# Altium schematic sheet 03cpu_sodimm.SchDoc
size B portrait
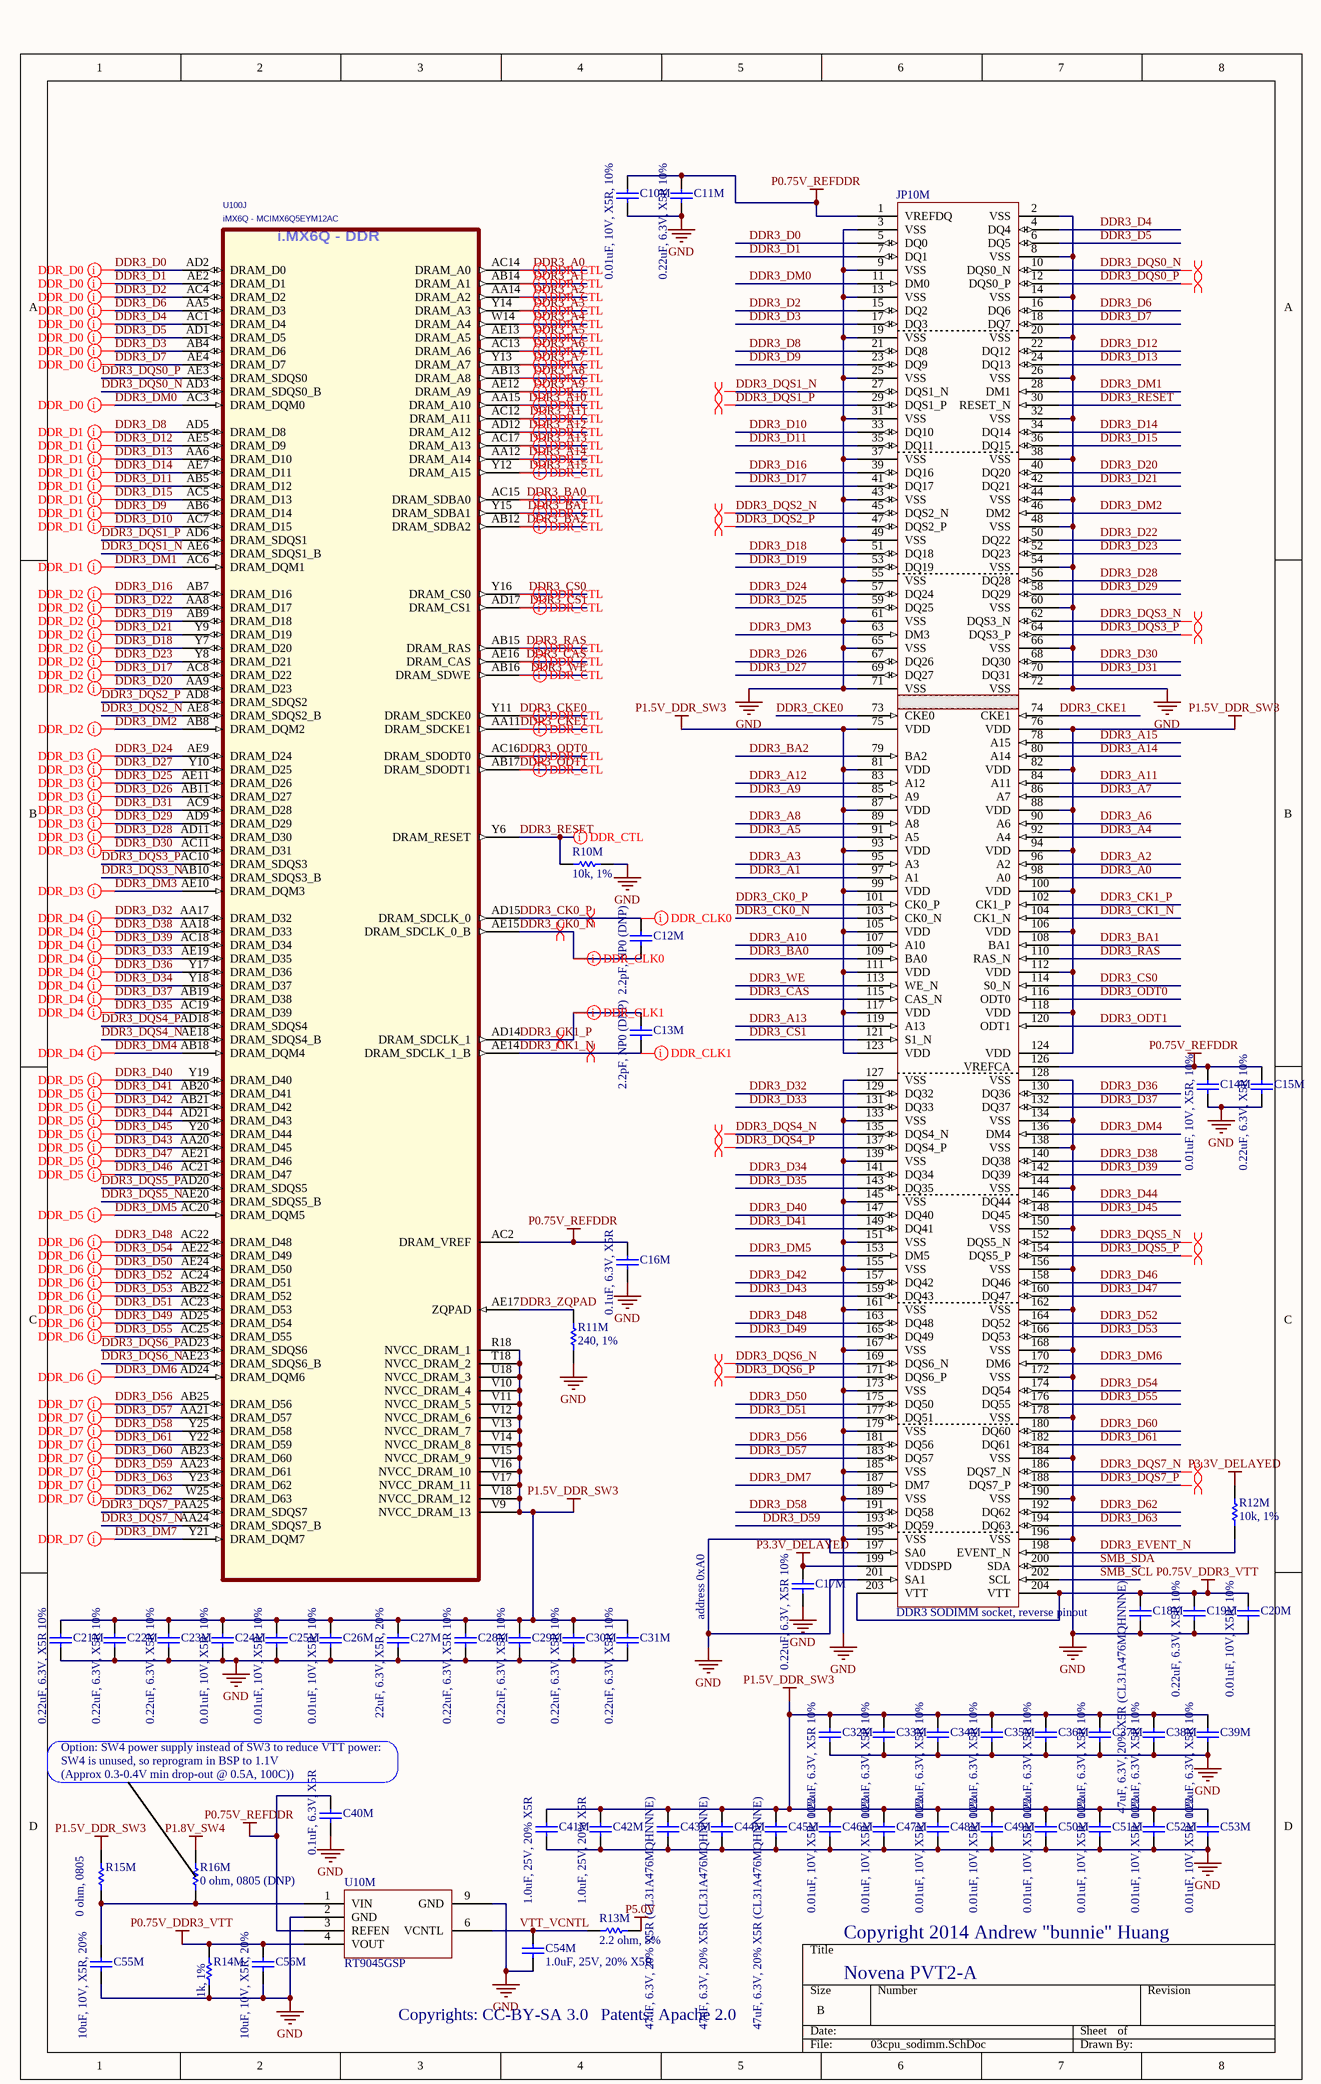
[diagram p0: 03cpu_sodimm.SchDoc]

## Parts
C10M  0.01uF, 10V, X5R, 10%  [CAPC0603N_B]
C11M  0.22uF, 6.3V, X5R 10%  [CAPC0603N_B]
C12M  2.2pF, NP0 (DNP)  [CAPC1005N]
C13M  2.2pF, NP0 (DNP)  [CAPC1005N]
C14M  0.01uF, 10V, X5R, 10%  [CAPC0603N_B]
C15M  0.22uF, 6.3V, X5R 10%  [CAPC0603N_B]
C16M  0.1uF, 6.3V, X5R  [CAPC0603N_B]
C17M  0.22uF, 6.3V, X5R 10%  [CAPC0603N_B]
C18M  47uF, 6.3V, 20% X5R (CL31A476MQHNNNE)  [CAPC3216N]
C19M  0.22uF, 6.3V, X5R 10%  [CAPC0603N_B]
C20M  0.01uF, 10V, X5R, 10%  [CAPC0603N_B]
C21M  0.22uF, 6.3V, X5R 10%  [CAPC0603N_B]
C22M  0.22uF, 6.3V, X5R 10%  [CAPC0603N_B]
C23M  0.22uF, 6.3V, X5R 10%  [CAPC0603N_B]
C24M  0.01uF, 10V, X5R, 10%  [CAPC0603N_B]
C25M  0.01uF, 10V, X5R, 10%  [CAPC0603N_B]
C26M  0.01uF, 10V, X5R, 10%  [CAPC0603N_B]
C27M  22uF, 6.3V, X5R, 20%  [CAPC1608N_HD]
C28M  0.22uF, 6.3V, X5R 10%  [CAPC0603N_B]
C29M  0.22uF, 6.3V, X5R 10%  [CAPC0603N_B]
C30M  0.22uF, 6.3V, X5R 10%  [CAPC0603N_B]
C31M  0.22uF, 6.3V, X5R 10%  [CAPC0603N_B]
C32M  0.22uF, 6.3V, X5R 10%  [CAPC0603N_B]
C33M  0.22uF, 6.3V, X5R 10%  [CAPC0603N_B]
C34M  0.22uF, 6.3V, X5R 10%  [CAPC0603N_B]
C35M  0.22uF, 6.3V, X5R 10%  [CAPC0603N_B]
C36M  0.22uF, 6.3V, X5R 10%  [CAPC0603N_B]
C37M  0.22uF, 6.3V, X5R 10%  [CAPC0603N_B]
C38M  0.22uF, 6.3V, X5R 10%  [CAPC0603N_B]
C39M  0.22uF, 6.3V, X5R 10%  [CAPC0603N_B]
C40M  0.1uF, 6.3V, X5R  [CAPC0603N_B]
C41M  1.0uF, 25V, 20% X5R  [CAPC1608N]
C42M  1.0uF, 25V, 20% X5R  [CAPC1608N]
C43M  47uF, 6.3V, 20% X5R (CL31A476MQHNNNE)  [CAPC3216N]
C44M  47uF, 6.3V, 20% X5R (CL31A476MQHNNNE)  [CAPC3216N]
C45M  47uF, 6.3V, 20% X5R (CL31A476MQHNNNE)  [CAPC3216N]
C46M  0.01uF, 10V, X5R, 10%  [CAPC0603N_B]
C47M  0.01uF, 10V, X5R, 10%  [CAPC0603N_B]
C48M  0.01uF, 10V, X5R, 10%  [CAPC0603N_B]
C49M  0.01uF, 10V, X5R, 10%  [CAPC0603N_B]
C50M  0.01uF, 10V, X5R, 10%  [CAPC0603N_B]
C51M  0.01uF, 10V, X5R, 10%  [CAPC0603N_B]
C52M  0.01uF, 10V, X5R, 10%  [CAPC0603N_B]
C53M  0.01uF, 10V, X5R, 10%  [CAPC0603N_B]
C54M  1.0uF, 25V, 20% X5R  [CAPC1608N]
C55M  10uF, 10V, X5R, 20%  [CAPC1608N]
C56M  10uF, 10V, X5R, 20%  [CAPC1608N]
JP10M  DDR3 SODIMM socket, reverse pinout  [DDR3_SODIMM_REV]
R10M  10k, 1%  [RESC1005N]
R11M  240, 1%  [RESC1005N]
R12M  10k, 1%  [RESC1005N]
R13M  2.2 ohm, 5%  [RESC1005N]
R14M  1k, 1%  [RESC1005N]
R15M  0 ohm, 0805  [RESC2012N]
R16M  0 ohm, 0805 (DNP)  [RESC2012N]
U10M  RT9045GSP  [SOIC127P600_HS-8N]
U100  iMX6Q - MCIMX6Q5EYM12AC  [FREESCALE_BGA624C80P25X25_2100X2100X216]  (part J of 12)

## Nets
GND: C10M.2 C11M.2 C14M.2 C15M.2 C16M.2 C17M.2 C18M.2 C19M.2 C20M.2 C21M.2 C22M.2 C23M.2 C24M.2 C25M.2 C26M.2 C27M.2 C28M.2 C29M.2 C30M.2 C31M.2 C32M.2 C33M.2 C34M.2 C35M.2 C36M.2 C37M.2 C38M.2 C39M.2 C40M.2 C41M.2 C42M.2 C43M.2 C44M.2 C45M.2 C46M.2 C47M.2 C48M.2 C49M.2 C50M.2 C51M.2 C52M.2 C53M.2 C54M.2 C55M.2 C56M.2 JP10M.2(VSS) JP10M.3(VSS) JP10M.8(VSS) JP10M.9(VSS) JP10M.13(VSS) JP10M.14(VSS) JP10M.19(VSS) JP10M.20(VSS) JP10M.25(VSS) JP10M.26(VSS) JP10M.31(VSS) JP10M.32(VSS) JP10M.37(VSS) JP10M.38(VSS) JP10M.43(VSS) JP10M.44(VSS) JP10M.48(VSS) JP10M.49(VSS) JP10M.54(VSS) JP10M.55(VSS) JP10M.60(VSS) JP10M.61(VSS) JP10M.65(VSS) JP10M.66(VSS) JP10M.71(VSS) JP10M.72(VSS) JP10M.127(VSS) JP10M.128(VSS) JP10M.133(VSS) JP10M.134(VSS) JP10M.138(VSS) JP10M.139(VSS) JP10M.144(VSS) JP10M.145(VSS) JP10M.150(VSS) JP10M.151(VSS) JP10M.155(VSS) JP10M.156(VSS) JP10M.161(VSS) JP10M.162(VSS) JP10M.167(VSS) JP10M.168(VSS) JP10M.172(VSS) JP10M.173(VSS) JP10M.178(VSS) JP10M.179(VSS) JP10M.184(VSS) JP10M.185(VSS) JP10M.189(VSS) JP10M.190(VSS) JP10M.195(VSS) JP10M.196(VSS) JP10M.197(SA0) JP10M.201(SA1) R10M.2 R11M.2 R14M.2 U10M.2(GND) U10M.9(GND)
P0.75V_DDR3_VTT: C18M.1 C19M.1 C20M.1 C56M.1 JP10M.203(VTT) JP10M.204(VTT) R14M.1 U10M.4(VOUT)
P0.75V_REFDDR: C10M.1 C11M.1 C14M.1 C15M.1 C16M.1 C40M.1 JP10M.1(VREFDQ) JP10M.126(VREFCA) U10M.3(REFEN) U100.AC2(DRAM_VREF)
P1.5V_DDR_SW3: C21M.1 C22M.1 C23M.1 C24M.1 C25M.1 C26M.1 C27M.1 C28M.1 C29M.1 C30M.1 C31M.1 C32M.1 C33M.1 C34M.1 C35M.1 C36M.1 C37M.1 C38M.1 C39M.1 C41M.1 C42M.1 C43M.1 C44M.1 C45M.1 C46M.1 C47M.1 C48M.1 C49M.1 C50M.1 C51M.1 C52M.1 C53M.1 JP10M.75(VDD) JP10M.76(VDD) JP10M.81(VDD) JP10M.82(VDD) JP10M.87(VDD) JP10M.88(VDD) JP10M.93(VDD) JP10M.94(VDD) JP10M.99(VDD) JP10M.100(VDD) JP10M.105(VDD) JP10M.106(VDD) JP10M.111(VDD) JP10M.112(VDD) JP10M.117(VDD) JP10M.118(VDD) JP10M.123(VDD) JP10M.124(VDD) R15M.1 U100.R18(NVCC_DRAM_1) U100.T18(NVCC_DRAM_2) U100.U18(NVCC_DRAM_3) U100.V9(NVCC_DRAM_13) U100.V10(NVCC_DRAM_4) U100.V11(NVCC_DRAM_5) U100.V12(NVCC_DRAM_6) U100.V13(NVCC_DRAM_7) U100.V14(NVCC_DRAM_8) U100.V15(NVCC_DRAM_9) U100.V16(NVCC_DRAM_10) U100.V17(NVCC_DRAM_11) U100.V18(NVCC_DRAM_12)
P1.8V_SW4: R16M.1
P3.3V_DELAYED: C17M.1 JP10M.199(VDDSPD) R12M.1
P5.0V: R13M.1
DDR3_A0: JP10M.98(A0) U100.AC14(DRAM_A0)
DDR3_A1: JP10M.97(A1) U100.AB14(DRAM_A1)
DDR3_A2: JP10M.96(A2) U100.AA14(DRAM_A2)
DDR3_A3: JP10M.95(A3) U100.Y14(DRAM_A3)
DDR3_A4: JP10M.92(A4) U100.W14(DRAM_A4)
DDR3_A5: JP10M.91(A5) U100.AE13(DRAM_A5)
DDR3_A6: JP10M.90(A6) U100.AC13(DRAM_A6)
DDR3_A7: JP10M.86(A7) U100.Y13(DRAM_A7)
DDR3_A8: JP10M.89(A8) U100.AB13(DRAM_A8)
DDR3_A9: JP10M.85(A9) U100.AE12(DRAM_A9)
DDR3_A10: JP10M.107(A10) U100.AA15(DRAM_A10)
DDR3_A11: JP10M.84(A11) U100.AC12(DRAM_A11)
DDR3_A12: JP10M.83(A12) U100.AD12(DRAM_A12)
DDR3_A13: JP10M.119(A13) U100.AC17(DRAM_A13)
DDR3_A14: JP10M.80(A14) U100.AA12(DRAM_A14)
DDR3_A15: JP10M.78(A15) U100.Y12(DRAM_A15)
DDR3_BA0: JP10M.109(BA0) U100.AC15(DRAM_SDBA0)
DDR3_BA1: JP10M.108(BA1) U100.Y15(DRAM_SDBA1)
DDR3_BA2: JP10M.79(BA2) U100.AB12(DRAM_SDBA2)
DDR3_CAS: JP10M.115(CAS_N) U100.AE16(DRAM_CAS)
DDR3_CK0_N: C12M.2 JP10M.103(CK0_N) U100.AE15(DRAM_SDCLK_0_B)
DDR3_CK0_P: C12M.1 JP10M.101(CK0_P) U100.AD15(DRAM_SDCLK_0)
DDR3_CK1_N: C13M.2 JP10M.104(CK1_N) U100.AE14(DRAM_SDCLK_1_B)
DDR3_CK1_P: C13M.1 JP10M.102(CK1_P) U100.AD14(DRAM_SDCLK_1)
DDR3_CKE0: JP10M.73(CKE0) U100.Y11(DRAM_SDCKE0)
DDR3_CKE1: JP10M.74(CKE1) U100.AA11(DRAM_SDCKE1)
DDR3_CS0: JP10M.114(S0_N) U100.Y16(DRAM_CS0)
DDR3_CS1: JP10M.121(S1_N) U100.AD17(DRAM_CS1)
DDR3_D0: JP10M.5(DQ0) U100.AD2(DRAM_D0)
DDR3_D1: JP10M.7(DQ1) U100.AE2(DRAM_D1)
DDR3_D2: JP10M.15(DQ2) U100.AC4(DRAM_D2)
DDR3_D3: JP10M.17(DQ3) U100.AB4(DRAM_D6)
DDR3_D4: JP10M.4(DQ4) U100.AC1(DRAM_D4)
DDR3_D5: JP10M.6(DQ5) U100.AD1(DRAM_D5)
DDR3_D6: JP10M.16(DQ6) U100.AA5(DRAM_D3)
DDR3_D7: JP10M.18(DQ7) U100.AE4(DRAM_D7)
DDR3_D8: JP10M.21(DQ8) U100.AD5(DRAM_D8)
DDR3_D9: JP10M.23(DQ9) U100.AB6(DRAM_D14)
DDR3_D10: JP10M.33(DQ10) U100.AC7(DRAM_D15)
DDR3_D11: JP10M.35(DQ11) U100.AB5(DRAM_D12)
DDR3_D12: JP10M.22(DQ12) U100.AE5(DRAM_D9)
DDR3_D13: JP10M.24(DQ13) U100.AA6(DRAM_D10)
DDR3_D14: JP10M.34(DQ14) U100.AE7(DRAM_D11)
DDR3_D15: JP10M.36(DQ15) U100.AC5(DRAM_D13)
DDR3_D16: JP10M.39(DQ16) U100.AB7(DRAM_D16)
DDR3_D17: JP10M.41(DQ17) U100.AC8(DRAM_D22)
DDR3_D18: JP10M.51(DQ18) U100.Y7(DRAM_D20)
DDR3_D19: JP10M.53(DQ19) U100.AB9(DRAM_D18)
DDR3_D20: JP10M.40(DQ20) U100.AA9(DRAM_D23)
DDR3_D21: JP10M.42(DQ21) U100.Y9(DRAM_D19)
DDR3_D22: JP10M.50(DQ22) U100.AA8(DRAM_D17)
DDR3_D23: JP10M.52(DQ23) U100.Y8(DRAM_D21)
DDR3_D24: JP10M.57(DQ24) U100.AE9(DRAM_D24)
DDR3_D25: JP10M.59(DQ25) U100.AE11(DRAM_D26)
DDR3_D26: JP10M.67(DQ26) U100.AB11(DRAM_D27)
DDR3_D27: JP10M.69(DQ27) U100.Y10(DRAM_D25)
DDR3_D28: JP10M.56(DQ28) U100.AD11(DRAM_D30)
DDR3_D29: JP10M.58(DQ29) U100.AD9(DRAM_D29)
DDR3_D30: JP10M.68(DQ30) U100.AC11(DRAM_D31)
DDR3_D31: JP10M.70(DQ31) U100.AC9(DRAM_D28)
DDR3_D32: JP10M.129(DQ32) U100.AA17(DRAM_D32)
DDR3_D33: JP10M.131(DQ33) U100.AE19(DRAM_D35)
DDR3_D34: JP10M.141(DQ34) U100.Y18(DRAM_D37)
DDR3_D35: JP10M.143(DQ35) U100.AC19(DRAM_D39)
DDR3_D36: JP10M.130(DQ36) U100.Y17(DRAM_D36)
DDR3_D37: JP10M.132(DQ37) U100.AB19(DRAM_D38)
DDR3_D38: JP10M.140(DQ38) U100.AA18(DRAM_D33)
DDR3_D39: JP10M.142(DQ39) U100.AC18(DRAM_D34)
DDR3_D40: JP10M.147(DQ40) U100.Y19(DRAM_D40)
DDR3_D41: JP10M.149(DQ41) U100.AB20(DRAM_D41)
DDR3_D42: JP10M.157(DQ42) U100.AB21(DRAM_D42)
DDR3_D43: JP10M.159(DQ43) U100.AA20(DRAM_D45)
DDR3_D44: JP10M.146(DQ44) U100.AD21(DRAM_D43)
DDR3_D45: JP10M.148(DQ45) U100.Y20(DRAM_D44)
DDR3_D46: JP10M.158(DQ46) U100.AC21(DRAM_D47)
DDR3_D47: JP10M.160(DQ47) U100.AE21(DRAM_D46)
DDR3_D48: JP10M.163(DQ48) U100.AC22(DRAM_D48)
DDR3_D49: JP10M.165(DQ49) U100.AD25(DRAM_D54)
DDR3_D50: JP10M.175(DQ50) U100.AE24(DRAM_D50)
DDR3_D51: JP10M.177(DQ51) U100.AC23(DRAM_D53)
DDR3_D52: JP10M.164(DQ52) U100.AC24(DRAM_D51)
DDR3_D53: JP10M.166(DQ53) U100.AB22(DRAM_D52)
DDR3_D54: JP10M.174(DQ54) U100.AE22(DRAM_D49)
DDR3_D55: JP10M.176(DQ55) U100.AC25(DRAM_D55)
DDR3_D56: JP10M.181(DQ56) U100.AB25(DRAM_D56)
DDR3_D57: JP10M.183(DQ57) U100.AA21(DRAM_D57)
DDR3_D58: JP10M.191(DQ58) U100.Y25(DRAM_D58)
DDR3_D59: JP10M.193(DQ59) U100.AA23(DRAM_D61)
DDR3_D60: JP10M.180(DQ60) U100.AB23(DRAM_D60)
DDR3_D61: JP10M.182(DQ61) U100.Y22(DRAM_D59)
DDR3_D62: JP10M.192(DQ62) U100.W25(DRAM_D63)
DDR3_D63: JP10M.194(DQ63) U100.Y23(DRAM_D62)
DDR3_DM0: JP10M.11(DM0) U100.AC3(DRAM_DQM0)
DDR3_DM1: JP10M.28(DM1) U100.AC6(DRAM_DQM1)
DDR3_DM2: JP10M.46(DM2) U100.AB8(DRAM_DQM2)
DDR3_DM3: JP10M.63(DM3) U100.AE10(DRAM_DQM3)
DDR3_DM4: JP10M.136(DM4) U100.AB18(DRAM_DQM4)
DDR3_DM5: JP10M.153(DM5) U100.AC20(DRAM_DQM5)
DDR3_DM6: JP10M.170(DM6) U100.AD24(DRAM_DQM6)
DDR3_DM7: JP10M.187(DM7) U100.Y21(DRAM_DQM7)
DDR3_DQS0_N: JP10M.10(DQS0_N) U100.AD3(DRAM_SDQS0_B)
DDR3_DQS0_P: JP10M.12(DQS0_P) U100.AE3(DRAM_SDQS0)
DDR3_DQS1_N: JP10M.27(DQS1_N) U100.AE6(DRAM_SDQS1_B)
DDR3_DQS1_P: JP10M.29(DQS1_P) U100.AD6(DRAM_SDQS1)
DDR3_DQS2_N: JP10M.45(DQS2_N) U100.AE8(DRAM_SDQS2_B)
DDR3_DQS2_P: JP10M.47(DQS2_P) U100.AD8(DRAM_SDQS2)
DDR3_DQS3_N: JP10M.62(DQS3_N) U100.AB10(DRAM_SDQS3_B)
DDR3_DQS3_P: JP10M.64(DQS3_P) U100.AC10(DRAM_SDQS3)
DDR3_DQS4_N: JP10M.135(DQS4_N) U100.AE18(DRAM_SDQS4_B)
DDR3_DQS4_P: JP10M.137(DQS4_P) U100.AD18(DRAM_SDQS4)
DDR3_DQS5_N: JP10M.152(DQS5_N) U100.AE20(DRAM_SDQS5_B)
DDR3_DQS5_P: JP10M.154(DQS5_P) U100.AD20(DRAM_SDQS5)
DDR3_DQS6_N: JP10M.169(DQS6_N) U100.AE23(DRAM_SDQS6_B)
DDR3_DQS6_P: JP10M.171(DQS6_P) U100.AD23(DRAM_SDQS6)
DDR3_DQS7_N: JP10M.186(DQS7_N) U100.AA24(DRAM_SDQS7_B)
DDR3_DQS7_P: JP10M.188(DQS7_P) U100.AA25(DRAM_SDQS7)
DDR3_EVENT_N: JP10M.198(EVENT_N) R12M.2
DDR3_ODT0: JP10M.116(ODT0) U100.AC16(DRAM_SDODT0)
DDR3_ODT1: JP10M.120(ODT1) U100.AB17(DRAM_SDODT1)
DDR3_RAS: JP10M.110(RAS_N) U100.AB15(DRAM_RAS)
DDR3_RESET: JP10M.30(RESET_N) R10M.1 U100.Y6(DRAM_RESET)
DDR3_WE: JP10M.113(WE_N) U100.AB16(DRAM_SDWE)
DDR3_ZQPAD: R11M.1 U100.AE17(ZQPAD)
SMB_SCL: JP10M.202(SCL)
SMB_SDA: JP10M.200(SDA)
VTT_VCNTL: C54M.1 R13M.2 U10M.6(VCNTL)
NetC55M_1: C55M.1 R15M.2 R16M.2 U10M.1(VIN)

## Layout directives
differential pair: DDR3_CK0_N, DDR3_CK0_P, DDR3_CK1_N, DDR3_CK1_P, DDR3_DQS0_N, DDR3_DQS0_P, DDR3_DQS1_N, DDR3_DQS1_P, DDR3_DQS2_N, DDR3_DQS2_P, DDR3_DQS3_N, DDR3_DQS3_P, DDR3_DQS4_N, DDR3_DQS4_P, DDR3_DQS5_N, DDR3_DQS5_P, DDR3_DQS6_N, DDR3_DQS6_P, DDR3_DQS7_N, DDR3_DQS7_P
net class DDR_D0: DDR3_D0, DDR3_D1, DDR3_D2, DDR3_D3, DDR3_D4, DDR3_D5, DDR3_D6, DDR3_D7, DDR3_DM0
net class DDR_D1: DDR3_D8, DDR3_D9, DDR3_D10, DDR3_D11, DDR3_D12, DDR3_D13, DDR3_D14, DDR3_D15, DDR3_DM1
net class DDR_D2: DDR3_D16, DDR3_D17, DDR3_D18, DDR3_D19, DDR3_D20, DDR3_D21, DDR3_D22, DDR3_D23, DDR3_DM2
net class DDR_D3: DDR3_D24, DDR3_D25, DDR3_D26, DDR3_D27, DDR3_D28, DDR3_D29, DDR3_D30, DDR3_D31, DDR3_DM3
net class DDR_D4: DDR3_D32, DDR3_D33, DDR3_D34, DDR3_D35, DDR3_D36, DDR3_D37, DDR3_D38, DDR3_D39, DDR3_DM4
net class DDR_D5: DDR3_D40, DDR3_D41, DDR3_D42, DDR3_D43, DDR3_D44, DDR3_D45, DDR3_D46, DDR3_D47, DDR3_DM5
net class DDR_D6: DDR3_D48, DDR3_D49, DDR3_D50, DDR3_D51, DDR3_D52, DDR3_D53, DDR3_D54, DDR3_D55, DDR3_DM6
net class DDR_D7: DDR3_D56, DDR3_D57, DDR3_D58, DDR3_D59, DDR3_D60, DDR3_D61, DDR3_D62, DDR3_D63, DDR3_DM7
net class DDR_CTL: DDR3_A0, DDR3_A1, DDR3_A2, DDR3_A3, DDR3_A4, DDR3_A5, DDR3_A6, DDR3_A7, DDR3_A8, DDR3_A9, DDR3_A10, DDR3_A11, DDR3_A12, DDR3_A13, DDR3_A14, DDR3_A15, DDR3_BA0, DDR3_BA1, DDR3_BA2, DDR3_CAS, DDR3_CKE0, DDR3_CKE1, DDR3_CS0, DDR3_CS1, DDR3_ODT0, DDR3_ODT1, DDR3_RAS, DDR3_RESET, DDR3_WE
net class DDR_CLK0: DDR3_CK0_N, DDR3_CK0_P
net class DDR_CLK1: DDR3_CK1_N, DDR3_CK1_P

## Notes on the sheet
- address 0xA0
- Option: SW4 power supply instead of SW3 to reduce VTT power:
- (near C40M) SW4 is unused, so reprogram in BSP to 1.1V
- (near C40M) (Approx 0.3-0.4V min drop-out @ 0.5A, 100C))
- Copyright 2014 Andrew "bunnie" Huang
- Copyrights: CC-BY-SA 3.0
- Patents: Apache 2.0
- Novena PVT2-A
- (in symbol PCIMX6Q6VV1A, part J) i.MX6Q - DDR

## Library data of the parts
C10M C12M C13M C14M C16M C18M C20M C24M C25M C26M C27M C40M C41M C42M C43M C44M C45M C46M C47M C48M C49M C50M C51M C52M C53M C54M C55M C56M = Cap Semi: Capacitor (Semiconductor SIM Model); Published: 8-Jun-2000; LatestRevisionDate: 17-Jul-2002; LatestRevisionNote: Re-released for DXP Platform.; PackageReference: C1206; Publisher: Altium Limited
C11M C15M C17M C19M C21M C22M C23M C28M C29M C30M C31M C32M C33M C34M C35M C36M C37M C38M C39M = Cap Semi: CAP CER 0.22UF 6.3V 20% X5R 0201; Published: 8-Jun-2000; LatestRevisionDate: 17-Jul-2002; LatestRevisionNote: Re-released for DXP Platform.; PackageReference: C1206; Publisher: Altium Limited
JP10M = DDR3_SODIMM: TE Connectivity 2013311 or equiv (9.2mm height)
R10M R11M R12M R13M R14M R15M R16M = Res1: Resistor; Value: 100k; Published: 8-Jun-2000; LatestRevisionDate: 17-Jul-2002; LatestRevisionNote: Re-released for DXP Platform.; PackageReference: AXIAL-0.3; Publisher: Altium Limited
U10M = RT9045GSP: 1.8A sink/source bus termination regulator (VTT)
U100 = PCIMX6Q6VV1A: PCIMX6Q5EVT10AC; PRE_APN: 344-01218; MFG_NAME01: Freescale Semiconductor; AGILE_PN: TMP-WF-14526; HARD_LOCATION: TRUE; HEIGHT: 2.16MM; ROHS: Yes; MFG_PN01: PCIMX6Q6VV1A